# EAGLE design PowerSupply (EAGLE 6.5.0)
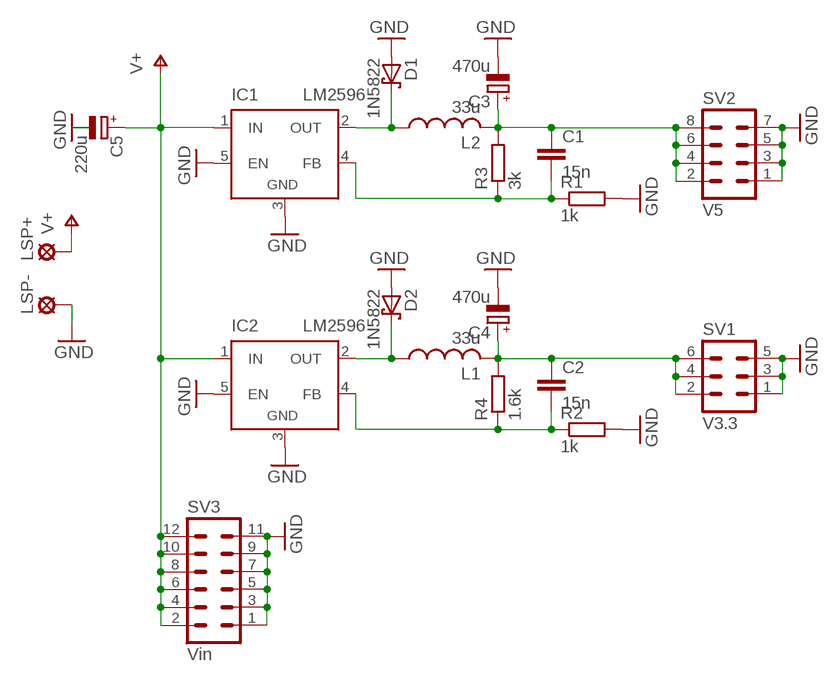
[diagram p0: schematic, sheet 1]

## Parts
C1  15n  C-EU075-032X103  [C075-032X103]
C2  15n  C-EU075-032X103  [C075-032X103]
C3  470u  CPOL-EUE2.5-6  [E2,5-6]
C4  470u  CPOL-EUE2.5-6  [E2,5-6]
C5  220u  CPOL-EUE2.5-6  [E2,5-6]
D1  1N5822  1N5819-T  [DO41-7.6]
D2  1N5822  1N5819-T  [DO41-7.6]
IC1  LM2596  LM2596TV  [TO220-51]
IC2  LM2596  LM2596TV  [TO220-51]
L1  33u  L-USTFI0510  [TFI0510]
L2  33u  L-USTFI0510  [TFI0510]
LSP+  SE14  [SE14]
LSP-  SE14  [SE14]
R1  1k  R-EU_0309/V  [0309V]
R2  1k  R-EU_0309/V  [0309V]
R3  3k  R-EU_0204/5  [0204/5]
R4  1.6k  R-EU_0204/5  [0204/5]
SV1  V3.3  MA03-2  [MA03-2]
SV2  V5  MA04-2  [MA04-2]
SV3  Vin  MA06-2  [MA06-2]

## Nets
GND: C3.- C4.- C5.- D1.A D2.A IC1.3(GND) IC1.5(EN) IC2.3(GND) IC2.5(EN) LSP-.MP R1.2 R2.2 SV1.1 SV1.3 SV1.5 SV2.1 SV2.3 SV2.5 SV2.7 SV3.1 SV3.3 SV3.5 SV3.7 SV3.9 SV3.11
N$1: C1.1 C3.+ L2.2 R3.2 SV2.2 SV2.4 SV2.6 SV2.8
N$2: D2.C IC2.2(OUT) L1.1
N$3: D1.C IC1.2(OUT) L2.1
N$4: C2.1 C4.+ L1.2 R4.2 SV1.2 SV1.4 SV1.6
N$5: C2.2 IC2.4(FB) R2.1 R4.1
N$6: C1.2 IC1.4(FB) R1.1 R3.1
V+: C5.+ IC1.1(IN) IC2.1(IN) LSP+.MP SV3.2 SV3.4 SV3.6 SV3.8 SV3.10 SV3.12

## Library data of the parts
C1 C2 = resistor:C-EU: CAPACITOR, European symbol
C3-C5 = resistor:CPOL-EU: POLARIZED CAPACITOR, European symbol
D1 D2 = diode:1N581*: 1.0A SCHOTTKY BARRIER RECTIFIER Source: http://www.diodes.com/datasheets/ds23001.pdf
IC1 IC2 = linear:LM2596T: STEP-DOWN VOLTAGE REGULATOR
L1 L2 = rcl:L-US: INDUCTOR, American symbol
LSP+ LSP- = solpad:SE14: SOLDER PAD E1553, drill 1,4mm, distributor Buerklin, 07F820
R1-R4 = resistor:R-EU_: RESISTOR, European symbol
SV1 = con-lstb:MA03-2: PIN HEADER; OC_FARNELL: unknown; OC_NEWARK: unknown
SV2 = con-lstb:MA04-2: PIN HEADER; OC_FARNELL: unknown; OC_NEWARK: unknown
SV3 = con-lstb:MA06-2: PIN HEADER; OC_FARNELL: unknown; OC_NEWARK: unknown

## Board
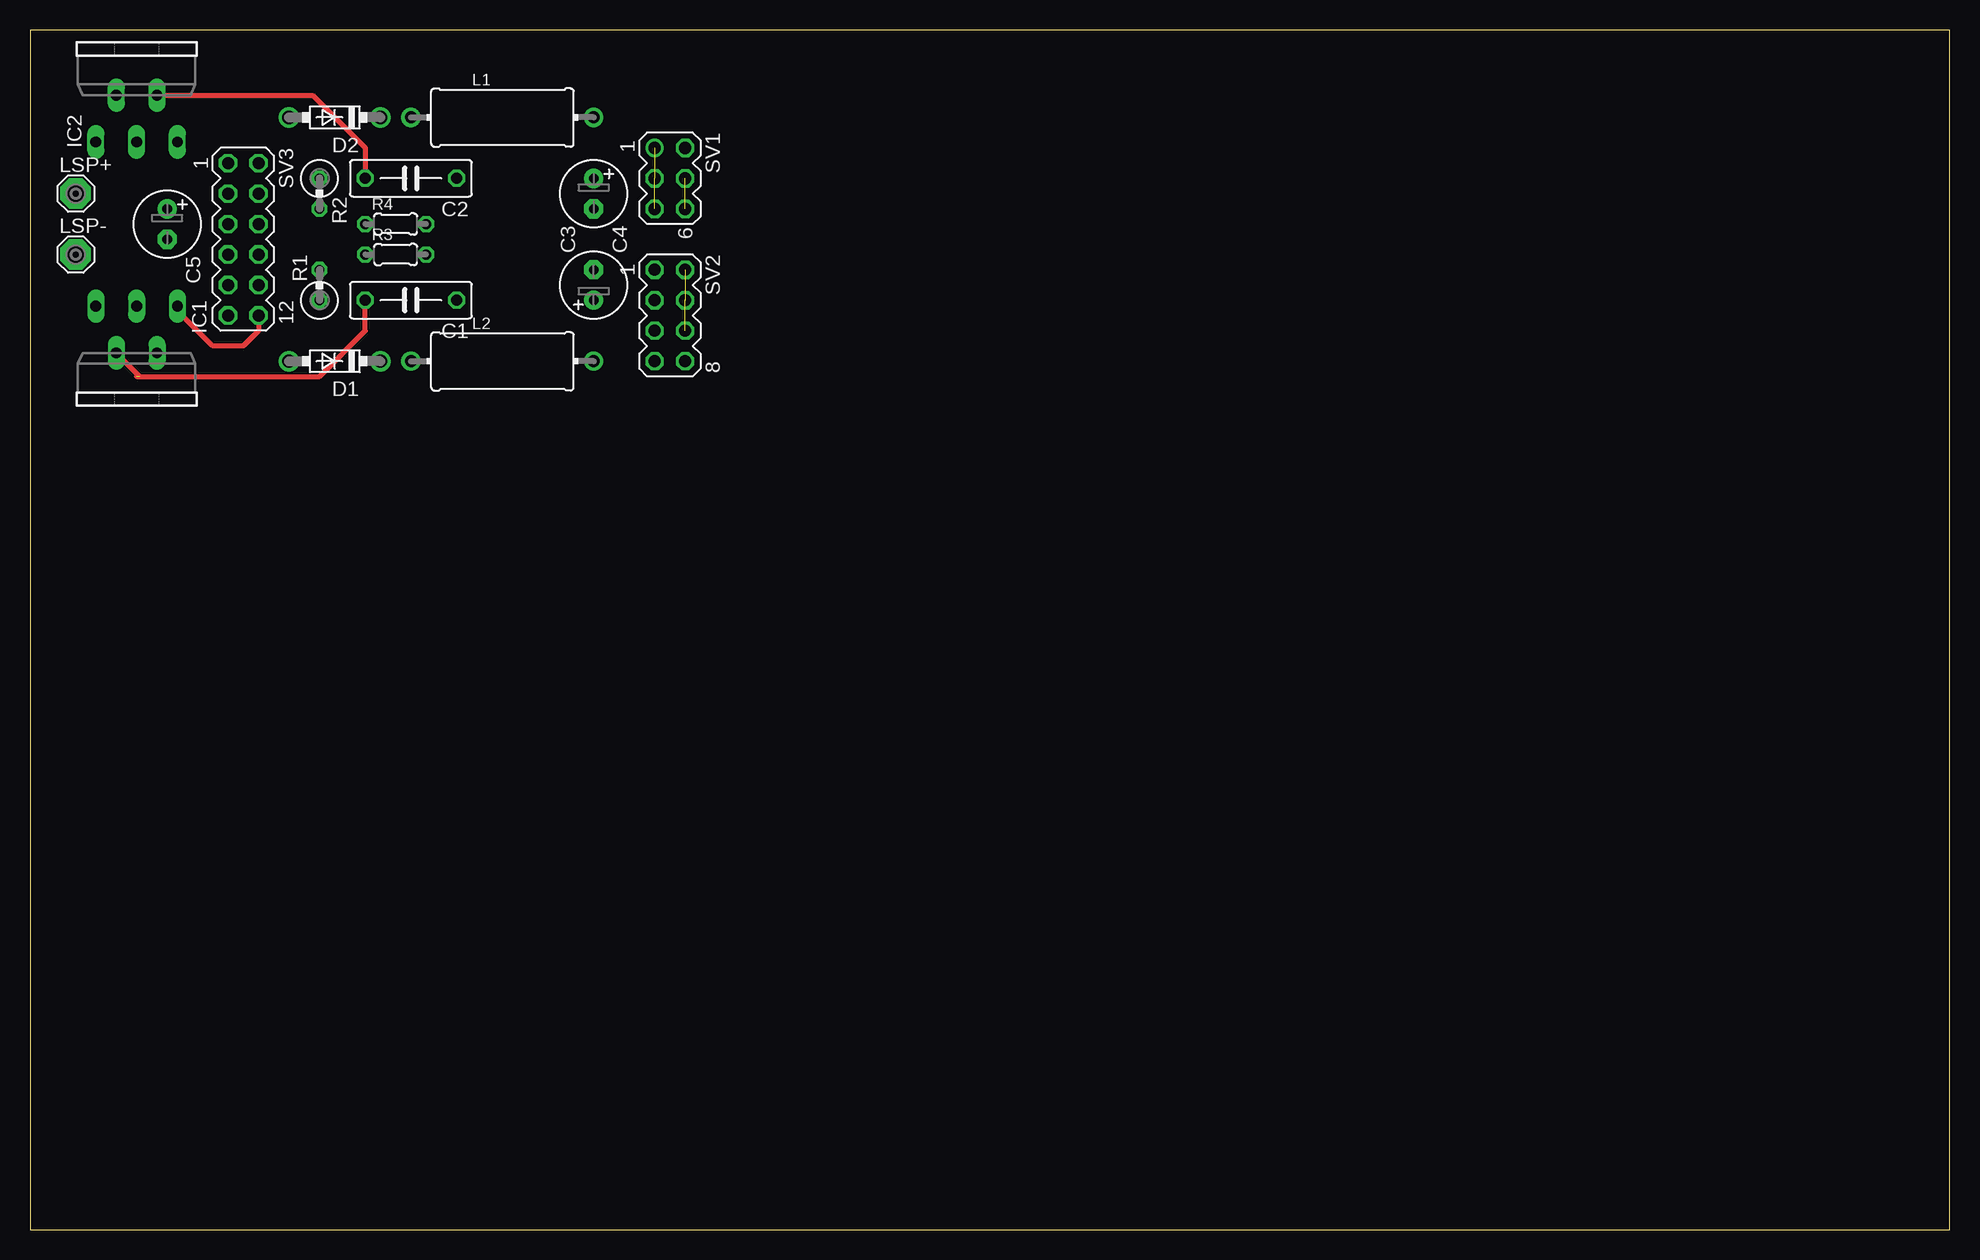
[diagram p1: board, top side]
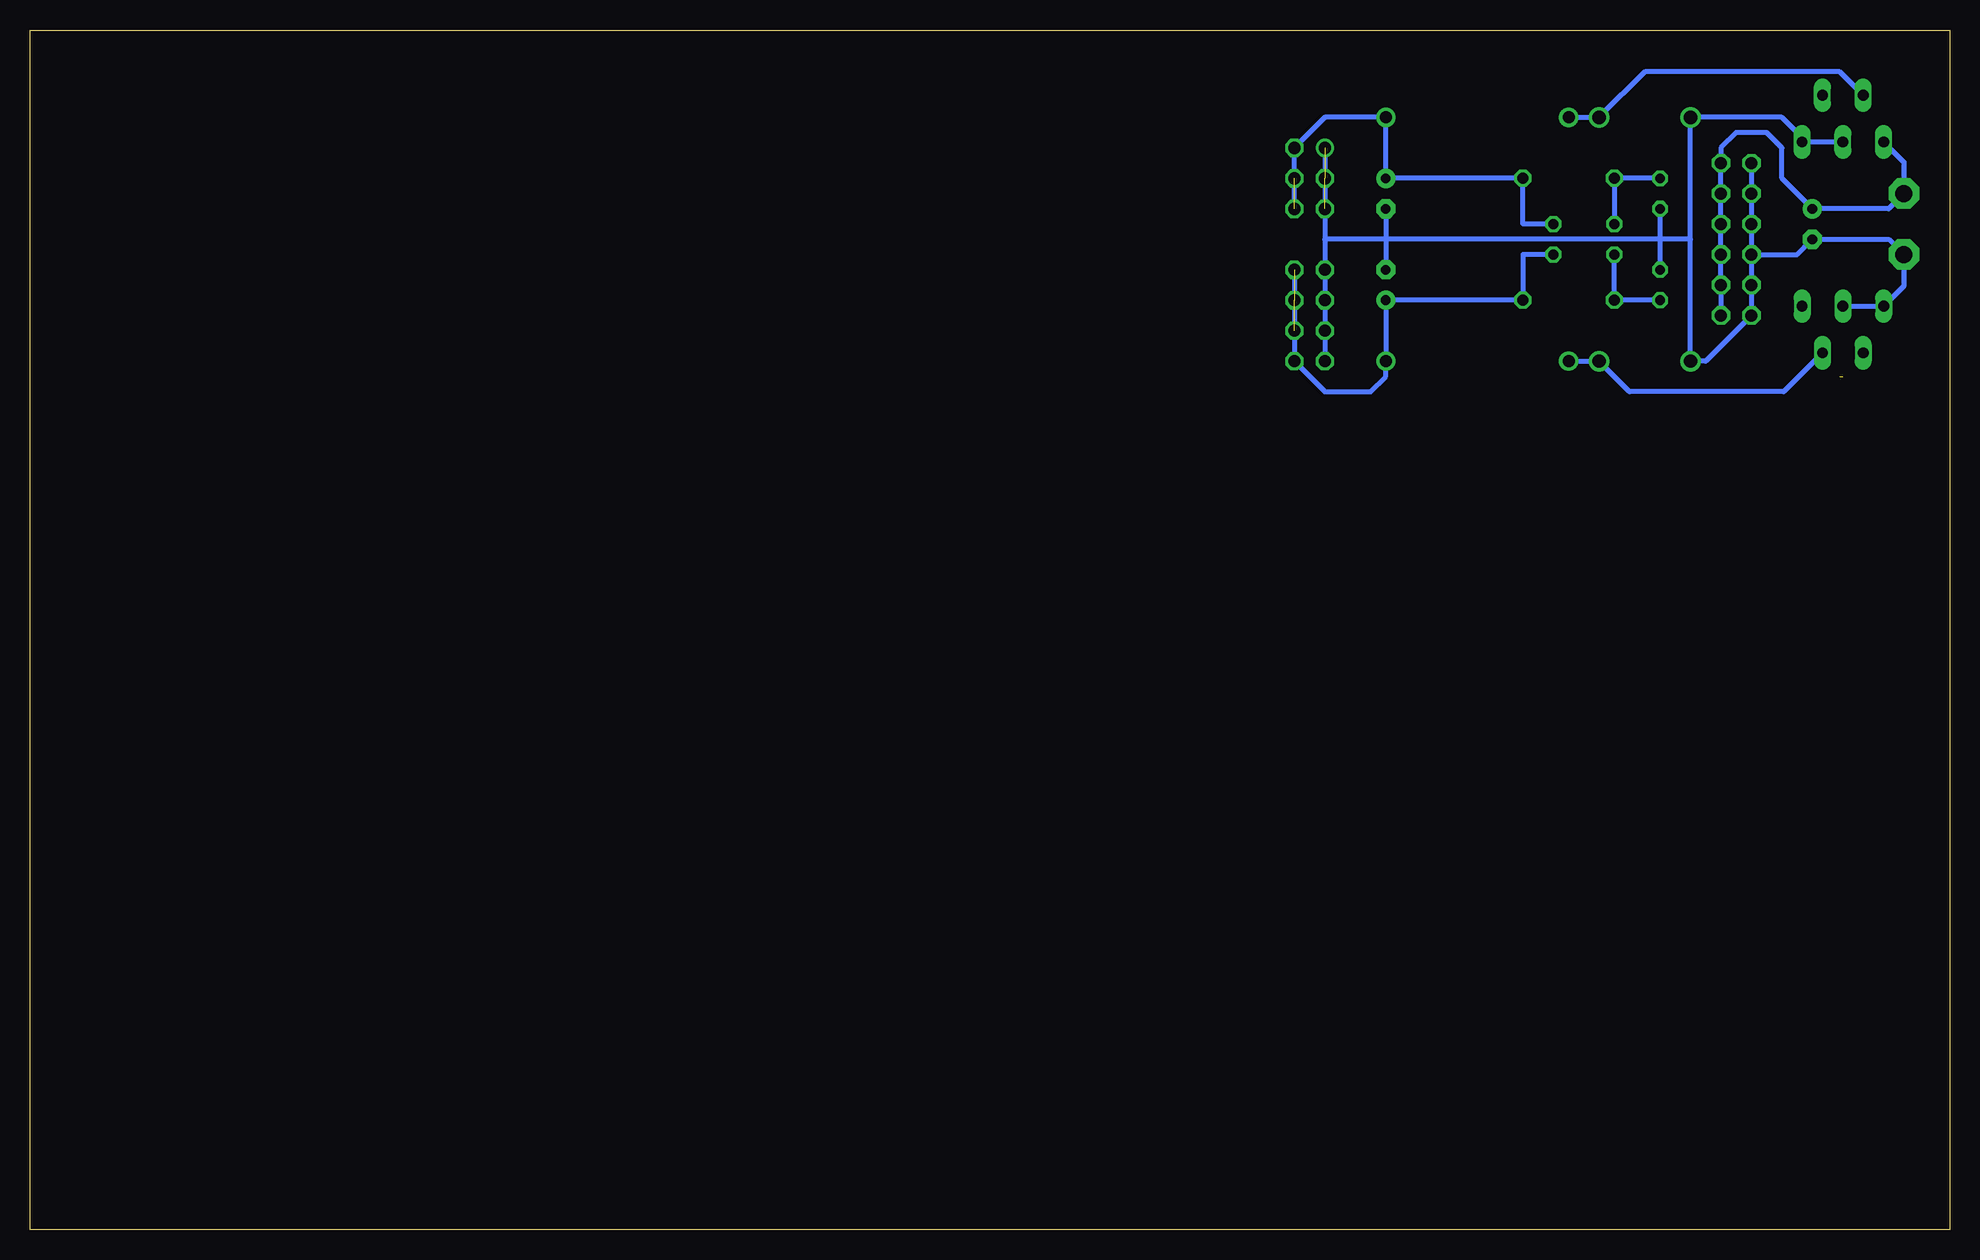
[diagram p2: board, bottom side, seen from below]

Size 160 x 100 mm. Coordinates in mm from the lower left corner, seen from the top.
Outline: 0,0 160,0 160,100 0,100 0,0
Copper layers (1*16): Top 0.035mm / dielectric 1.5mm / Bottom 0.035mm
Design rules "default": minimum track width 10mil, minimum drill 24mil, track to track 8mil, track to pad 8mil, pad to pad 8mil, via to via 8mil, smd to smd 8mil, copper to edge 40mil, drill to drill 8mil, minimum pad ring 10mil, minimum via ring 8mil, stop-mask expansion 4mil, vias tented up to drill 0mil, thermal gap 10mil

### Footprints (pad centres in the part's own frame; a part is rotated, then mirrored left to right if it is on the bottom)
C075-032X103 = drill 0.914 octagon: 1 -3.81,0; 2 3.81,0
E2,5-6 = drill 0.813 pad 1.6: + -1.27,0 | drill 0.813 pad 1.6 octagon: - 1.27,0
DO41-7.6 = drill 1.1 pad 1.7: A 3.81,0; C -3.81,0
TO220-51 = drill 0.9 long: 1 -3.4,-8.4; 2 -1.7,-4.5; 3 0,-8.4; 4 1.7,-4.5; 5 3.4,-8.4
TFI0510 = drill 1 pad 1.6: 1 -7.62,0; 2 7.62,0
SE14 = drill 1.397 pad 2.54 octagon: MP 0,0
0309V = drill 0.813 octagon: 1 -1.27,0; 2 1.27,0
0204/5 = drill 0.813 octagon: 1 -2.54,0; 2 2.54,0
MA03-2 = drill 1.016: 1 -2.54,-1.27 | drill 1.016 octagon: 2 -2.54,1.27; 3 0,-1.27; 4 0,1.27; 5 2.54,-1.27; 6 2.54,1.27
MA04-2 = drill 1.016 octagon: 1 -3.81,-1.27; 2 -3.81,1.27; 3 -1.27,-1.27; 4 -1.27,1.27; 5 1.27,-1.27; 6 1.27,1.27; 7 3.81,-1.27; 8 3.81,1.27
MA06-2 = drill 1.016 octagon: 1 -6.35,-1.27; 2 -6.35,1.27; 3 -3.81,-1.27; 4 -3.81,1.27; 5 -1.27,-1.27; 6 -1.27,1.27; 7 1.27,-1.27; 8 1.27,1.27; 9 3.81,-1.27; 10 3.81,1.27; 11 6.35,-1.27; 12 6.35,1.27

### Placement (x,y rotation side)
C1  31.75,77.47 180 top
C2  31.75,87.63 180 top
C3  46.99,78.74 90 top
C4  46.99,86.36 270 top
C5  11.43,83.82 270 top
D1  25.4,72.39 180 top
D2  25.4,92.71 180 top
IC1  8.89,68.58 180 top
IC2  8.89,99.06 0 top
L1  39.37,92.71 0 top
L2  39.37,72.39 0 top
LSP+  3.81,86.36 0 top
LSP-  3.81,81.28 0 top
R1  24.13,78.74 90 top
R2  24.13,86.36 270 top
R3  30.48,81.28 0 top
R4  30.48,83.82 0 top
SV1  53.34,87.63 270 top
SV2  53.34,76.2 270 top
SV3  17.78,82.55 270 top

### Tracks (layer width: path | path; a pad name or v marks a point on that pad's centre or on a via)
GND  (2 unrouted)
  Bottom 0.406: SV1.1 52.07,82.55 | C4.- 46.99,82.55 | 46.99,82.55 52.07,82.55 | 46.99,82.55 C3.- | SV3.7 SV3.9 SV3.11 | SV3.7 SV3.5 SV3.3 SV3.1 SV3.7 | 21.59,82.55 24.13,82.55 | 24.13,82.55 46.99,82.55 | IC2.5 12.7,90.66 12.7,91.44 | 21.59,82.55 D1.A 20.32,72.39 SV3.11 | 21.59,82.55 D2.A 13.97,92.71 12.29,91.03 IC2.5 | IC2.3 IC2.5 | 8.89,77.47 IC1.3 IC1.5 3.81,78.66 LSP-.MP 5.08,82.55 C5.- 12.7,81.28 SV3.7 | 24.13,82.55 R1.2 | R2.2 24.13,82.55 | 52.07,82.55 SV2.1 SV2.3 SV2.5 SV2.7 | SV3.7 SV3.11
N$1  (2 unrouted)
  Bottom 0.406: SV2.2 SV2.8 52.07,69.85 48.26,69.85 46.99,71.12 L2.2 C3.+ C1.1 35.56,81.28 R3.2
N$2
  Bottom 0.406: L1.1 D2.C 25.4,96.52 9.15,96.52 IC2.2
N$3
  Bottom 0.406: L2.1 D1.C 26.67,69.85 13.82,69.85 IC1.2
N$4  (1 unrouted)
  Bottom 0.406: SV1.6 SV1.2 52.07,92.71 L1.2 C4.+ C2.1 35.56,83.82 R4.2
N$5
  Top 0.406: IC2.4 23.55,94.56 27.94,90.17 C2.2
  Bottom 0.406: R2.1 C2.2 R4.1
N$6  (1 unrouted)
  Top 0.406: 9.15,71.12 IC1.4 | 8.89,71.12 24.13,71.12 27.94,74.93 C1.2
  Bottom 0.406: R1.1 C1.2 R3.1
V+
  Top 0.406: SV3.12 19.05,74.93 17.78,73.66 15.24,73.66 12.7,76.2 12.7,76.57 IC1.1
  Bottom 0.406: SV3.12 SV3.10 SV3.8 SV3.6 SV3.4 SV3.2 19.05,90.17 17.78,91.44 15.24,91.44 13.97,90.17 13.97,87.63 C5.+ 5.08,85.09 LSP+.MP 3.81,88.98 IC2.1